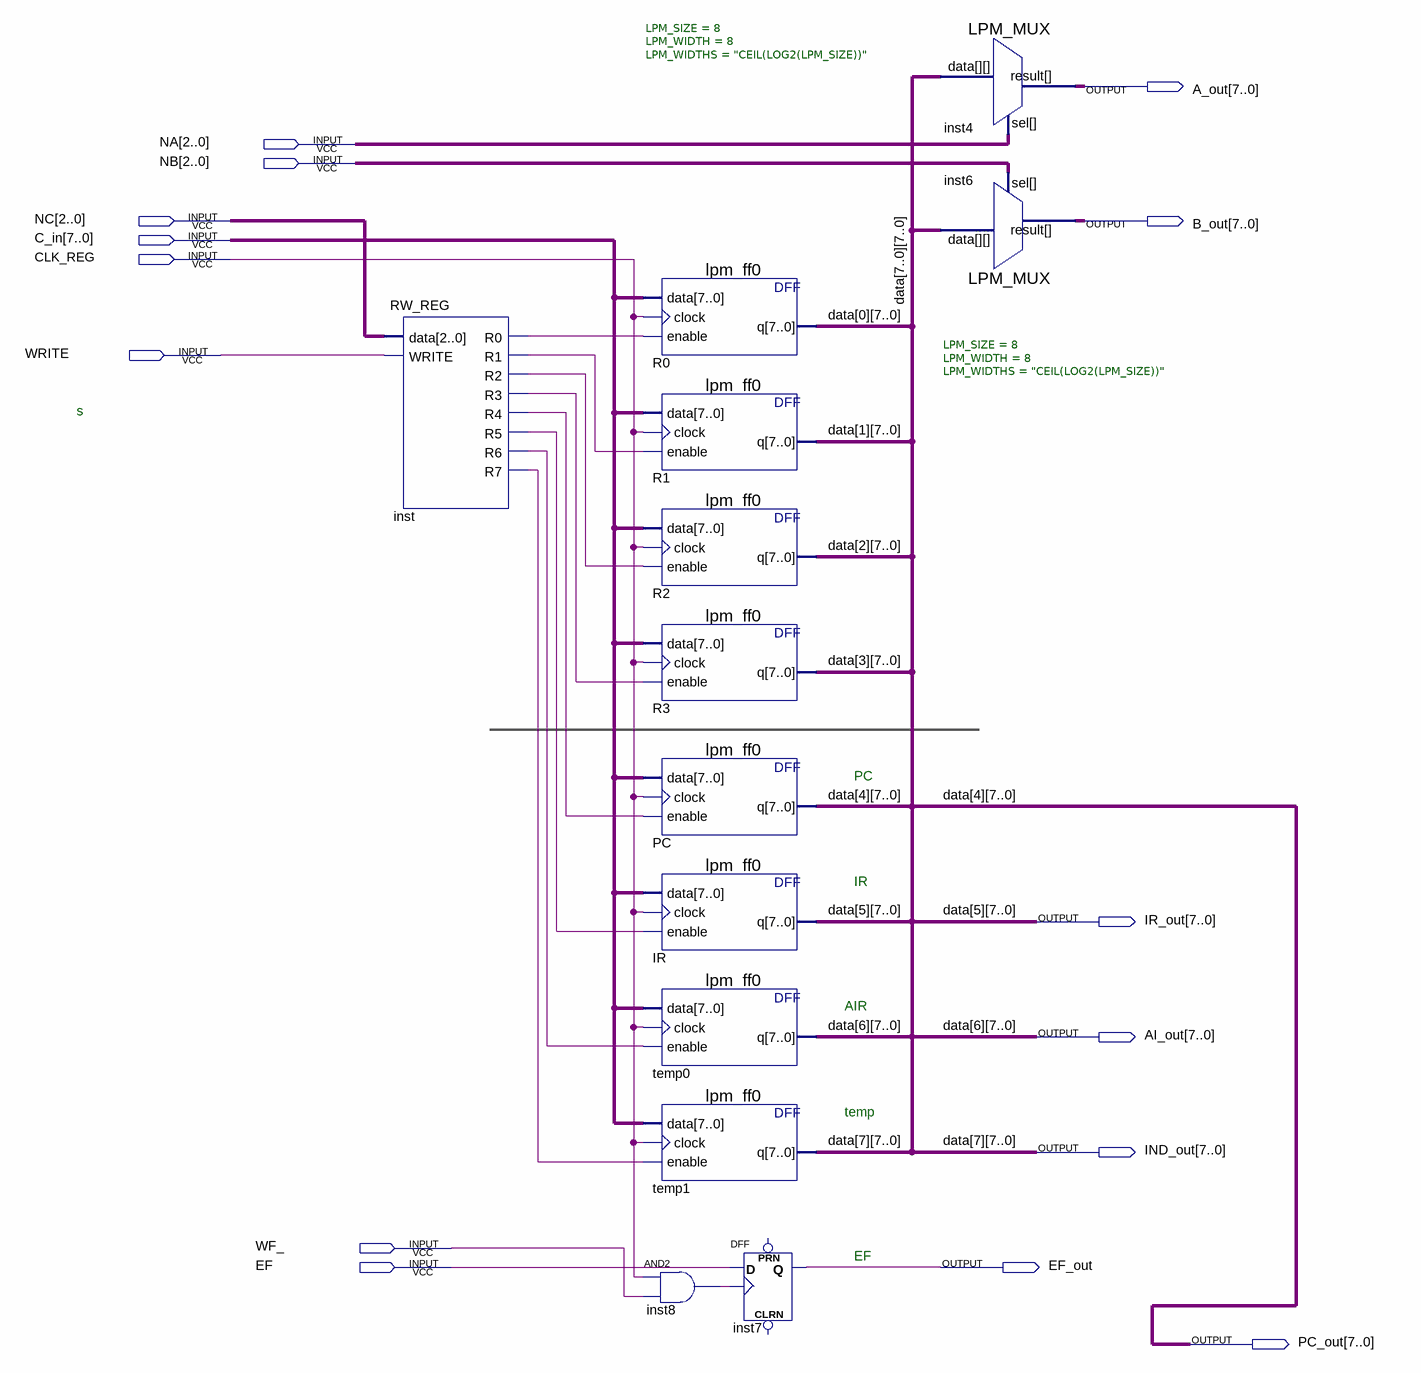
[diagram p0: schematic sheet]
// Quartus schematic REG.bdf as structural Verilog: 13 symbols, 15 pins
module REG (
  input  [2:0] NA,
  input  [2:0] NB,
  input  [2:0] NC,
  input  [7:0] C_in,
  input  CLK_REG,
  input  WRITE,
  input  WF_,
  input  EF,
  output [7:0] A_out,
  output [7:0] B_out,
  output [7:0] IR_out,
  output [7:0] AI_out,
  output [7:0] IND_out,
  output EF_out,
  output [7:0] PC_out
);

  wire inst8_out, inst_r0, inst_r1, inst_r2, inst_r3, inst_r4, inst_r5, inst_r6, inst_r7;
  wire [7:0] data_0, data_1, data_2, data_3;

  RW_REG inst (
    .data(NC), .WRITE(WRITE), .R0(inst_r0), .R1(inst_r1), .R2(inst_r2), .R3(inst_r3), .R4(inst_r4),
    .R5(inst_r5), .R6(inst_r6), .R7(inst_r7));
  lpm_ff0 R0 (.data(C_in), .clock(CLK_REG), .enable(inst_r0), .q(data_0));
  lpm_ff0 R1 (.data(C_in), .clock(CLK_REG), .enable(inst_r1), .q(data_1));
  lpm_ff0 R2 (.data(C_in), .clock(CLK_REG), .enable(inst_r2), .q(data_2));
  lpm_ff0 R3 (.data(C_in), .clock(CLK_REG), .enable(inst_r3), .q(data_3));
  lpm_ff0 PC (.data(C_in), .clock(CLK_REG), .enable(inst_r4), .q(PC_out));
  lpm_ff0 IR (.data(C_in), .clock(CLK_REG), .enable(inst_r5), .q(IR_out));
  lpm_ff0 temp0 (.data(C_in), .clock(CLK_REG), .enable(inst_r6), .q(AI_out));
  lpm_ff0 temp1 (.data(C_in), .clock(CLK_REG), .enable(inst_r7), .q(IND_out));
  and inst8 (inst8_out, CLK_REG, WF_);
  DFF inst7 (.CLK(inst8_out), .D(EF), .Q(EF_out));  // open: CLRN, PRN
  LPM_MUX #(.LPM_SIZE(8), .LPM_WIDTH(8), .LPM_WIDTHS("CEIL(LOG2(LPM_SIZE))")) inst4 (
    .data({IND_out, AI_out, IR_out, PC_out, data_3, data_2, data_1, data_0}), .sel(NA), .result(A_out));
  LPM_MUX #(.LPM_SIZE(8), .LPM_WIDTH(8), .LPM_WIDTHS("CEIL(LOG2(LPM_SIZE))")) inst6 (
    .data({IND_out, AI_out, IR_out, PC_out, data_3, data_2, data_1, data_0}), .sel(NB), .result(B_out));

  // Other names for the same wires on the sheet: data_4[7:0] = PC_out; data_5[7:0] = IR_out; data_6[7:0] = AI_out;
  //   data_7[7:0] = IND_out

  // Notes on the sheet:
  //   s
  //   PC
  //   IR
  //   AIR
  //   temp
  //   EF
endmodule
